# Altium schematic sheet 16 Ethernet.SchDoc
size B; DocumentNumber: 16; SheetNumber: 16; SheetTotal: 17
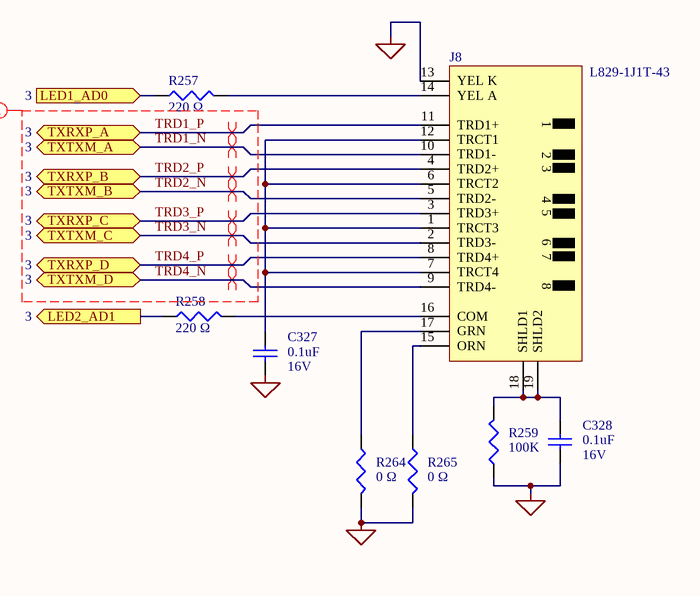
[diagram p0: 16 Ethernet.SchDoc]

## Parts
C327  value 0.1uF  Voltage: 16V  [CAP_0402]  (hidden comment: Cap 0.1uF 16V 0402)
C328  value 0.1uF  Voltage: 16V  [CAP_0402]  (hidden comment: Cap 0.1uF 16V 0402)
J8  L829-1J1T-43  [CON_Ethernet_L829-1J1T-43]
R257  value 220 Ω  [RES_0402]  (hidden comment: Res 220R 0.063W)
R258  value 220 Ω  [RES_0402]  (hidden comment: Res 220R 0.063W)
R259  value 100K  [RES_0402]  (hidden comment: Res 100K 0.1W)
R264  value 0 Ω  [RES_0402]  (hidden comment: Res 0 ohm 0.1W)
R265  value 0 Ω  [RES_0402]  (hidden comment: Res 0 ohm 0.1W)

## Ports
LED1_AD0 (in, see 3), LED2_AD1 (out, see 3), TXRXP_A (bidir, see 3), TXRXP_B (bidir, see 3), TXRXP_C (bidir, see 3), TXRXP_D (bidir, see 3), TXTXM_A (bidir, see 3), TXTXM_B (bidir, see 3), TXTXM_C (bidir, see 3), TXTXM_D (bidir, see 3)

## Nets
GND: C327.2 C328.2 J8.13(YEL_K) R259.1 R264.2 R265.2
LED1_AD0: R257.1 ; port LED1_AD0
LED2_AD1: R258.1 ; port LED2_AD1
TRD1_N: J8.10(TRD1-) ; port TXTXM_A
TRD1_P: J8.11(TRD1+) ; port TXRXP_A
TRD2_N: J8.5(TRD2-) ; port TXTXM_B
TRD2_P: J8.4(TRD2+) ; port TXRXP_B
TRD3_N: J8.2(TRD3-) ; port TXTXM_C
TRD3_P: J8.3(TRD3+) ; port TXRXP_C
TRD4_N: J8.9(TRD4-) ; port TXTXM_D
TRD4_P: J8.8(TRD4+) ; port TXRXP_D
NetC327_1: C327.1 J8.1(TRCT3) J8.6(TRCT2) J8.7(TRCT4) J8.12(TRCT1)
NetC328_1: C328.1 J8.18(SHLD1) J8.19(SHLD2) R259.2
NetJ8_14: J8.14(YEL_A) R257.2
NetJ8_15: J8.15(ORN) R265.1
NetJ8_16: J8.16(COM) R258.2
NetJ8_17: J8.17(GRN) R264.1

## Layout directives
net class ETHERNET 100ohm: TRD1_N, TRD1_P, TRD2_N, TRD2_P, TRD3_N, TRD3_P, TRD4_N, TRD4_P
differential pair: TRD1_N, TRD1_P, TRD2_N, TRD2_P, TRD3_N, TRD3_P, TRD4_N, TRD4_P

## Notes on the sheet
- Austin, Tx
- Title:
- First View Consultants
- 512.582.9102
- firstviewconsultants.com
- Drawn:
- Checked:
- File:
- Sheet
- of
- FVC #:
- Rev.
- Approved:
- Date:
- Time:

## Library data of the parts
C327 C328 = Cap 0.1uF 16V 0402: Cap, Cer, 0.1uF, 16V, 10%, X7R, 0402; Manufacturer #: GRM155R71C104KA88D; Manufacturer: Murata Electronics North America; Have Footprint: yes; Package: 0402; Tolerance: ±10%
J8 = L829-1J1T-43: Conn, Ethernet, 10/100/1000,G Base-T, TH; Manufacturer: Bel Fuse Inc; Manufacturer #: L829-1J1T-43
R257 R258 = Res 220R 0.063W: Res, 220R, 0.063W, 5%, 0402; Manufacturer #: RMCF0402JT220R; Manufacturer: Stackpole Electronics Inc; Have Footprint: yes; Package: 0402
R259 = Res 100K 0.1W: Res, 100K, 0.1W, 1%, 0402; Manufacturer #: ERJ-2RKF1003X; Manufacturer: Panasonic Electronic Components; Have Footprint: yes; Package: 0402
R264 R265 = Res 0 ohm 0.1W: Res, 0 ohm, 1/16W, 0402; Manufacturer #: CRCW04020000Z0ED; Manufacturer: Vishay Dale; Have Footprint: yes; Package: 0402